# Altium schematic sheet Sheet_1_2022-07-22.schdoc
size 455 x 178 mm
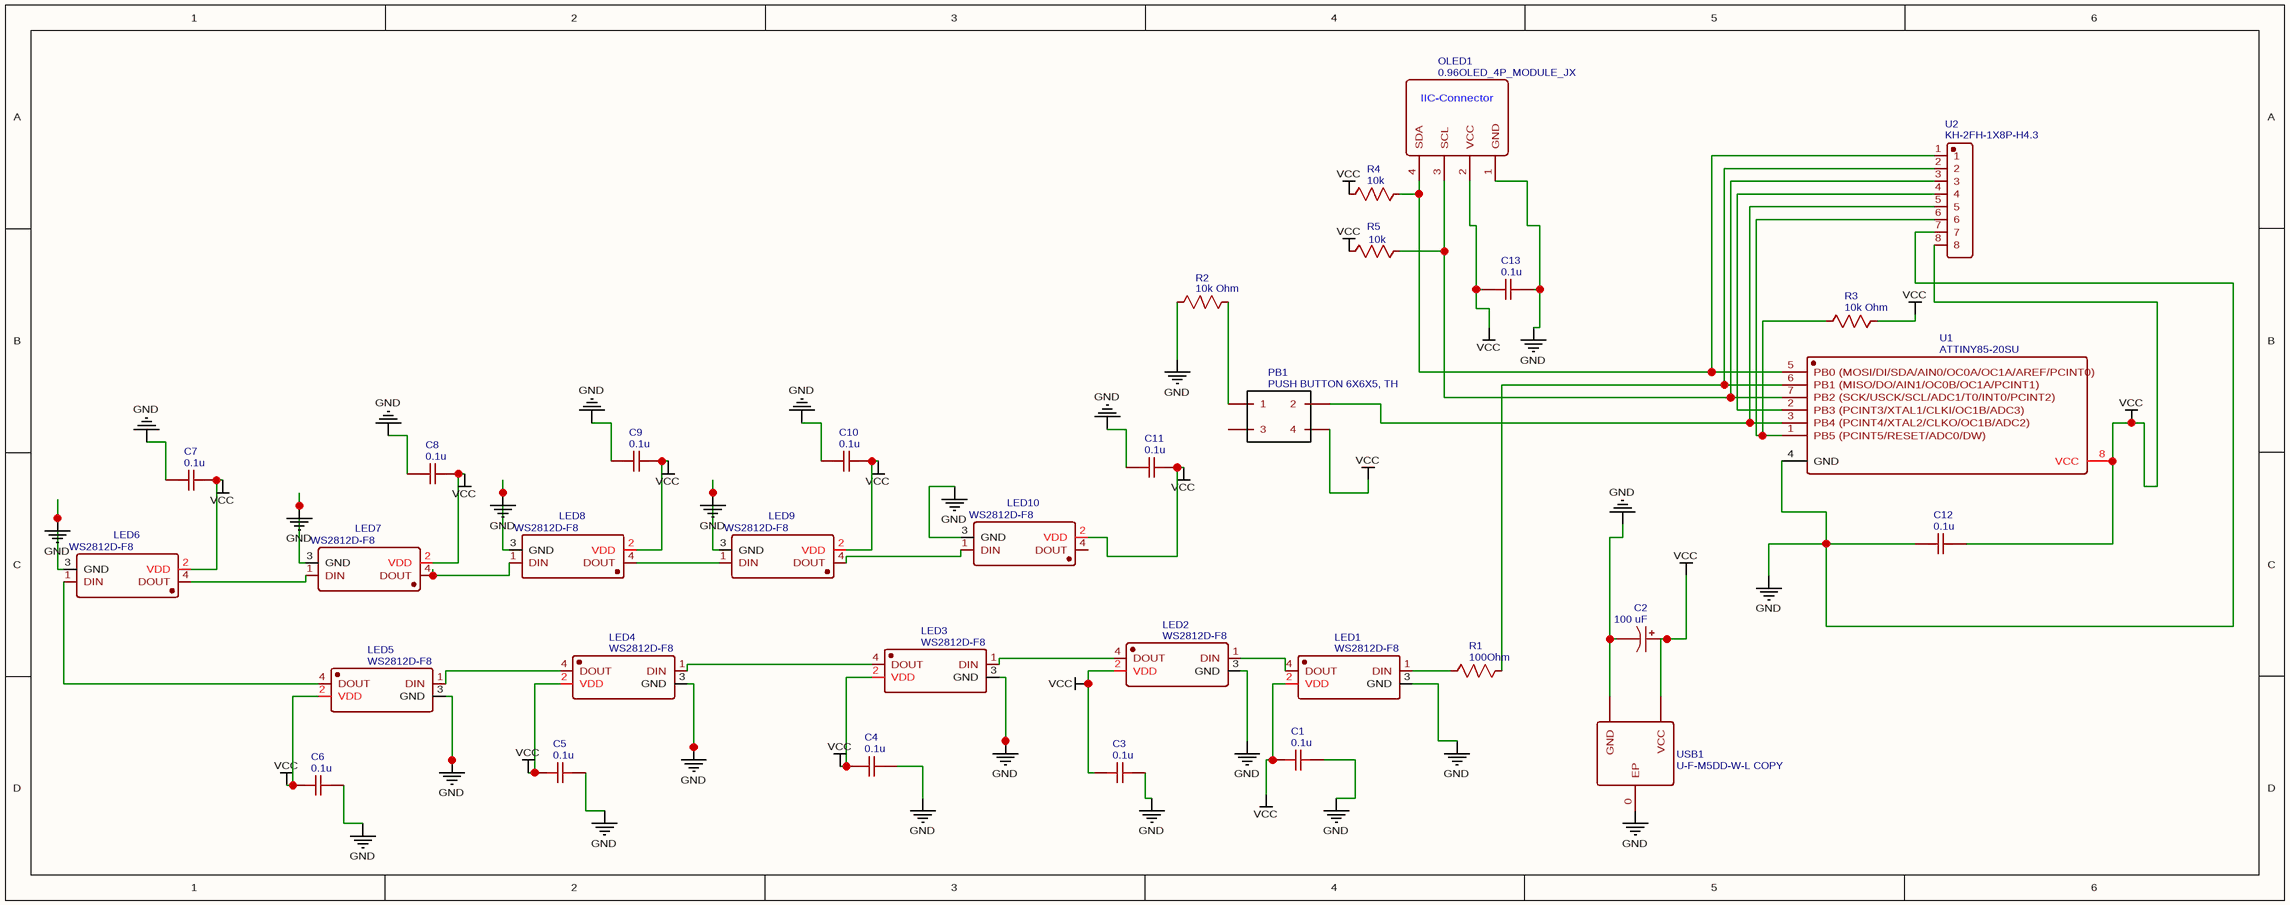
[diagram p0: Sheet_1_2022-07-22.schdoc]

## Parts
C1  0.1u  [C1206]
C2  100 uF  [CAP-D5.0×F2.0]
C3  0.1u  [C1206]
C4  0.1u  [C1206]
C5  0.1u  [C1206]
C6  0.1u  [C1206]
C7  0.1u  [C1206]
C8  0.1u  [C1206]
C9  0.1u  [C1206]
C10  0.1u  [C1206]
C11  0.1u  [C1206]
C12  0.1u  [C1206]
C13  0.1u  [C1206]
LED1  WS2812D-F8  [LED-TH_WS2812D-F8]
LED2  WS2812D-F8  [LED-TH_WS2812D-F8]
LED3  WS2812D-F8  [LED-TH_WS2812D-F8]
LED4  WS2812D-F8  [LED-TH_WS2812D-F8]
LED5  WS2812D-F8  [LED-TH_WS2812D-F8]
LED6  WS2812D-F8  [LED-TH_WS2812D-F8]
LED7  WS2812D-F8  [LED-TH_WS2812D-F8]
LED8  WS2812D-F8  [LED-TH_WS2812D-F8]
LED9  WS2812D-F8  [LED-TH_WS2812D-F8]
LED10  WS2812D-F8  [LED-TH_WS2812D-F8]
OLED1  0.96OLED_4P_MODULE_JX  [0.96OLED_4P]
PB1  PUSH BUTTON 6X6X5, TH  [PUSH BUTTON 6X6X5, TH]
R1  100Ohm  [R1206]
R2  10k Ohm  [R1206]
R3  10k Ohm  [R1206]
R4  10k  [R1206]
R5  10k  [R1206]
U1  ATTINY85-20SU  [SOIC-8_L5.3-W5.3-P1.27-LS8.0-BL]
U2  KH-2FH-1X8P-H4.3  [CONN-TH_8P-P2.00_KINGHELM_KH-2FH-1X8P-H4.3]
USB1  U-F-M5DD-W-L COPY  [MICRO-USB-SMD_MICRO-USB-18-NO-MID]

## Nets
GND: C1.2 C2.2 C3.2 C4.2 C5.2 C6.2 C7.1 C8.1 C9.1 C10.1 C11.1 C12.1 C13.2 LED1.3(GND) LED2.3(GND) LED3.3(GND) LED4.3(GND) LED5.3(GND) LED6.3(GND) LED7.3(GND) LED8.3(GND) LED9.3(GND) LED10.3(GND) OLED1.1(GND) R2.1 U1.4(GND) U2.7 USB1.0(EP) USB1.5(GND)
VCC: C1.1 C2.1 C3.1 C4.1 C5.1 C6.1 C7.2 C8.2 C9.2 C10.2 C11.2 C12.2 C13.1 LED1.2(VDD) LED2.2(VDD) LED3.2(VDD) LED4.2(VDD) LED5.2(VDD) LED6.2(VDD) LED7.2(VDD) LED8.2(VDD) LED9.2(VDD) LED10.2(VDD) OLED1.2(VCC) PB1.4 R3.2 R4.1 R5.1 U1.8(VCC) U2.8 USB1.1(VCC)
NetLED1_1: LED1.1(DIN) R1.1
NetLED1_4: LED1.4(DOUT) LED2.1(DIN)
NetLED2_4: LED2.4(DOUT) LED3.1(DIN)
NetLED3_4: LED3.4(DOUT) LED4.1(DIN)
NetLED4_4: LED4.4(DOUT) LED5.1(DIN)
NetLED5_4: LED5.4(DOUT) LED6.1(DIN)
NetLED6_4: LED6.4(DOUT) LED7.1(DIN)
NetLED7_4: LED7.4(DOUT) LED8.1(DIN)
NetLED8_4: LED8.4(DOUT) LED9.1(DIN)
NetLED9_4: LED9.4(DOUT) LED10.1(DIN)
NetOLED1_3: OLED1.3(SCL) R5.2 U1.7(PB2_(SCK/USCK/SCL/ADC1/T0/INT0/PCINT2)) U2.3
NetOLED1_4: OLED1.4(SDA) R4.2 U1.5(PB0_(MOSI/DI/SDA/AIN0/OC0A/OC1A/AREF/PCINT0)) U2.1
NetPB1_1: PB1.1 R2.2
NetPB1_2: PB1.2 U1.3(PB4_(PCINT4/XTAL2/CLKO/OC1B/ADC2)) U2.5
NetR1_2: R1.2 U1.6(PB1_(MISO/DO/AIN1/OC0B/OC1A/PCINT1)) U2.2
NetR3_1: R3.1 U1.1(PB5_(PCINT5/RESET/ADC0/DW)) U2.6
NetU1_2: U1.2(PB3_(PCINT3/XTAL1/CLKI/OC1B/ADC3)) U2.4

Not connected (* = marked no-connect by the designer): LED10 4(DOUT); PB1 3

## Notes on the sheet
- (in symbol 0.96OLED_4P_MODULE_JX) IIC-Connector

## Library data of the parts
C1 C3-C13 = 0.1u: nameAlias: Value(F); Contributor: LCEDA_Lib; spicePre: C; spiceSymbolName: C_1206_US
C2 = 100 uF: nameAlias: Value(F); Contributor: LCEDA_Lib; spicePre: C; spiceSymbolName: CE_TH_D5.0×F2.0_US
LED1-LED10 = WS2812D-F8: BOM_Manufacturer: Worldsemi; Contributor: LCSC; BOM_Supplier: LCSC; BOM_Manufacturer Part: WS2812D-F8; BOM_Supplier Part: C139126; BOM_JLCPCB Part Class: Extended Part; spicePre: L; spiceSymbolName: WS2812D-F8
OLED1 = 0.96OLED_4P_MODULE_JX: BOM_Manufacturer: null; Contributor: LCSC; BOM_Supplier: LCSC; BOM_Supplier Part: C9900004566; BOM_Manufacturer Part: 0.96OLED_4P_MODULE_JX; BOM_JLCPCB Part Class: Extended Part; spicePre: O; spiceSymbolName: 0.96OLED_4P_MODULE_JX
PB1 = PUSH BUTTON 6X6X5, TH: Contributor: wylnux; spicePre: P; spiceSymbolName: PUSH BUTTON 6X6X5, TH
R1 = 100Ohm: nameAlias: Value(Ω); Contributor: LCEDA_Lib; spicePre: R; spiceSymbolName: R_1206_US
R2 R3 = 10k Ohm: nameAlias: Value(Ω); Contributor: LCEDA_Lib; spicePre: R; spiceSymbolName: R_1206_US
R4 R5 = 10k: nameAlias: Value(Ω); Contributor: LCEDA_Lib; spicePre: R; spiceSymbolName: R_1206_US
U1 = ATTINY85-20SU: BOM_Manufacturer: MICROCHIP; BOM_Supplier: LCSC; BOM_Manufacturer Part: ATTINY85-20SU; BOM_Supplier Part: C89852; BOM_JLCPCB Part Class: Extended Part; spicePre: U; spiceSymbolName: ATTINY85-20SU
U2 = KH-2FH-1X8P-H4.3: BOM_Manufacturer: kinghelm(金航标); Contributor: LCSC; BOM_Supplier: LCSC; BOM_Supplier Part: C2938433; BOM_Manufacturer Part: KH-2FH-1X8P-H4.3; spicePre: U; spiceSymbolName: KH-2FH-1X8P-H4.3
USB1 = U-F-M5DD-W-L COPY: BOM_Manufacturer: HRO; Contributor: LCSC; BOM_Supplier: LCSC; BOM_Manufacturer Part: U-F-M5DD-W-L; BOM_Supplier Part: C145792; BOM_JLCPCB Part Class: Extended Part; spicePre: U; spiceSymbolName: U-F-M5DD-W-L COPY